# Altium project MC3_r2.PrjPcb (part 1 of 10)
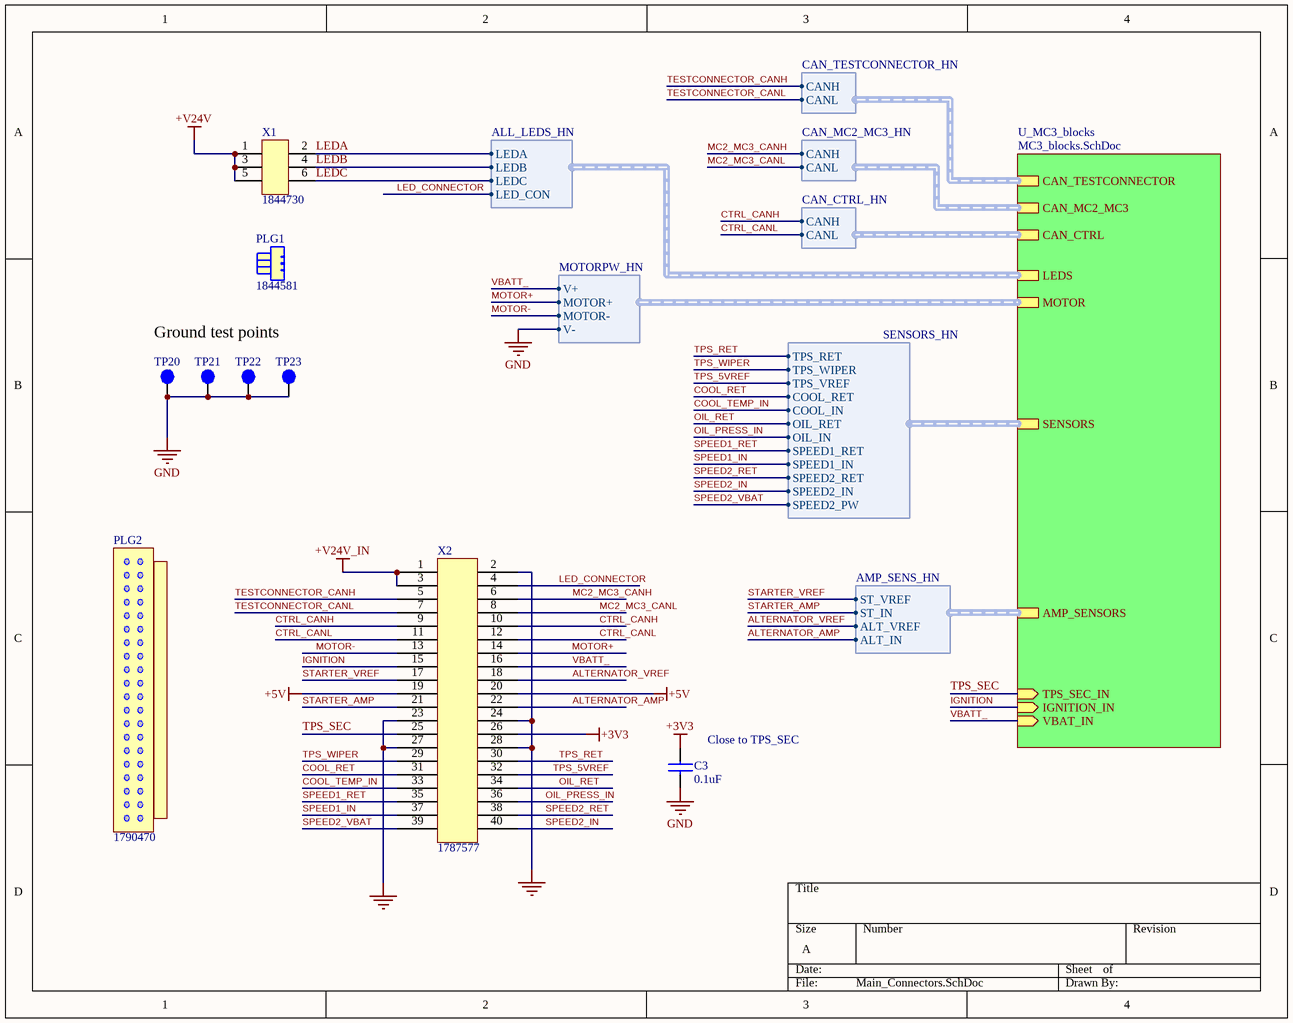
[diagram p0: Main_Connectors.SchDoc]
21 sheets, 353 parts. Net scope: hierarchical (ports join the sheet entries above them; power ports are global).
Board file: MC3.PcbDoc
Sheets:
  Main_Connectors.SchDoc
    U_MC3_blocks = MC3_blocks.SchDoc
      U_MC3_module = MC3_module.SchDoc
        U_CAN = CAN.SchDoc
        U_MC3_microcontroller = MC3_microcontroller.SchDoc
          U_I2cLevelShifter = I2cLevelShifter.SchDoc
        U_RPM Inputs = RPM Inputs.SchDoc
        U_AD_starter_alternator = AD_starter_alternator.SchDoc
        U_AD_Sensors = AD_Sensors.SchDoc
        U_DigitalInputs = DigitalInputs.SchDoc
        U_MC_Connector = MC_Connector.SchDoc
          RLA = RelayG6K2FY.SchDoc
          RLB = RelayG6K2FY.SchDoc
          RLC = RelayG6K2FY.SchDoc
          RLD = RelayG6K2FY.SchDoc
          RLE = RelayG6K2FY.SchDoc
          RLF = RelayG6K2FY.SchDoc
        U_DCMotorControl = DCMotorControl.SchDoc
        U_TPS_secondary_wiper = TPS_secondary_wiper.SchDoc
        U_CAN2 = CAN.SchDoc
      U_PowerSupply = PowerSupply.SchDoc
      U_CanFaults = CanFaults.SchDoc
        A1P = FaultRelay.SchDoc
        A1N = FaultRelay.SchDoc
        B1P = FaultRelay.SchDoc
        B1N = FaultRelay.SchDoc
        C1P = FaultRelay.SchDoc
        C1N = FaultRelay.SchDoc
        CONA = CanConnector.SchDoc
        CONB = CanConnector.SchDoc
        CONC = CanConnector.SchDoc
      U_Fault_Module = Fault_Module.SchDoc
        U_FaultOptoNC = FaultOptoNC.SchDoc
        U_FaultOptoNC = FaultOptoNC.SchDoc
        U_FaultOptoNC = FaultOptoNC.SchDoc
        U_FaultOptoNO = FaultOptoNO.SchDoc

## Sheet Main_Connectors.SchDoc
size A; DocumentNumber: D_1; SheetNumber: 1; SheetTotal: 21

### Parts
C3  0.1uF  [C0805]
PLG1  1844581  (mechanical)
PLG2  1790470  (mechanical)
TP20  T  [TESTPOINTSMD_1x1MM]  (value not drawn)  (no BOM)
TP21  T  [TESTPOINTSMD_1x1MM]  (value not drawn)  (no BOM)
TP22  T  [TESTPOINTSMD_1x1MM]  (value not drawn)  (no BOM)
TP23  T  [TESTPOINTSMD_1x1MM]  (value not drawn)  (no BOM)
X1  1844730  [DMC 0,5/ 3-G1- 2,54 P20THR R24]
X2  1787577  [DMCV 1,5/20-G1F-3,5-LR P20THR]

### Sub-sheets
U_MC3_blocks = MC3_blocks.SchDoc: SENSORS (harness SENSORS_HN), CAN_TESTCONNECTOR (harness CAN_TESTCONNECTOR_HN), CAN_MC2_MC3 (harness CAN_MC2_MC3_HN), CAN_CTRL (harness CAN_CTRL_HN), LEDS (harness ALL_LEDS_HN), MOTOR (harness MOTORPW_HN), AMP_SENSORS (harness AMP_SENS_HN), TPS_SEC_IN (in), IGNITION_IN (in), VBAT_IN (in)

### Harnesses
CAN_TESTCONNECTOR_HN: CANH, CANL
CAN_MC2_MC3_HN: CANH, CANL
CAN_CTRL_HN: CANH, CANL
ALL_LEDS_HN: LEDA, LEDB, LEDC, LED_CON
MOTORPW_HN: V+, MOTOR+, MOTOR-, V-
SENSORS_HN: TPS_RET, TPS_WIPER, TPS_VREF, COOL_RET, COOL_IN, OIL_RET, OIL_IN, SPEED1_RET, SPEED1_IN, SPEED2_RET, SPEED2_IN, SPEED2_PW
AMP_SENS_HN: ST_VREF, ST_IN, ALT_VREF, ALT_IN

### Nets
+3V3: C3.1 X2.26
+5V: X2.19 X2.20
+V24V: X1.1 X1.3 X1.5
+V24V_IN: X2.1 X2.3
GND: C3.2 TP20.1 TP21.1 TP22.1 TP23.1 X2.2 X2.23 X2.24 X2.27 X2.28 ; sheet U_MC3_blocks/MOTOR.V-
ALTERNATOR_AMP: X2.22 ; sheet U_MC3_blocks/AMP_SENSORS.ALT_IN
ALTERNATOR_VREF: X2.18 ; sheet U_MC3_blocks/AMP_SENSORS.ALT_VREF
COOL_RET: X2.31 ; sheet U_MC3_blocks/SENSORS.COOL_RET
COOL_TEMP_IN: X2.33 ; sheet U_MC3_blocks/SENSORS.COOL_IN
CTRL_CANH: X2.9 X2.10 ; sheet U_MC3_blocks/CAN_CTRL.CANH
CTRL_CANL: X2.11 X2.12 ; sheet U_MC3_blocks/CAN_CTRL.CANL
IGNITION: X2.15 ; sheet U_MC3_blocks/IGNITION_IN
LED_CONNECTOR: X2.4 ; sheet U_MC3_blocks/LEDS.LED_CON
LEDA: X1.2 ; sheet U_MC3_blocks/LEDS.LEDA
LEDB: X1.4 ; sheet U_MC3_blocks/LEDS.LEDB
LEDC: X1.6 ; sheet U_MC3_blocks/LEDS.LEDC
MC2_MC3_CANH: X2.6 ; sheet U_MC3_blocks/CAN_MC2_MC3.CANH
MC2_MC3_CANL: X2.8 ; sheet U_MC3_blocks/CAN_MC2_MC3.CANL
MOTOR+: X2.14 ; sheet U_MC3_blocks/MOTOR.MOTOR+
MOTOR-: X2.13 ; sheet U_MC3_blocks/MOTOR.MOTOR-
OIL_PRESS_IN: X2.36 ; sheet U_MC3_blocks/SENSORS.OIL_IN
OIL_RET: X2.34 ; sheet U_MC3_blocks/SENSORS.OIL_RET
SPEED1_IN: X2.37 ; sheet U_MC3_blocks/SENSORS.SPEED1_IN
SPEED1_RET: X2.35 ; sheet U_MC3_blocks/SENSORS.SPEED1_RET
SPEED2_IN: X2.40 ; sheet U_MC3_blocks/SENSORS.SPEED2_IN
SPEED2_RET: X2.38 ; sheet U_MC3_blocks/SENSORS.SPEED2_RET
SPEED2_VBAT: X2.39 ; sheet U_MC3_blocks/SENSORS.SPEED2_PW
STARTER_AMP: X2.21 ; sheet U_MC3_blocks/AMP_SENSORS.ST_IN
STARTER_VREF: X2.17 ; sheet U_MC3_blocks/AMP_SENSORS.ST_VREF
TESTCONNECTOR_CANH: X2.5 ; sheet U_MC3_blocks/CAN_TESTCONNECTOR.CANH
TESTCONNECTOR_CANL: X2.7 ; sheet U_MC3_blocks/CAN_TESTCONNECTOR.CANL
TPS_5VREF: X2.32 ; sheet U_MC3_blocks/SENSORS.TPS_VREF
TPS_RET: X2.30 ; sheet U_MC3_blocks/SENSORS.TPS_RET
TPS_SEC: X2.25 ; sheet U_MC3_blocks/TPS_SEC_IN
TPS_WIPER: X2.29 ; sheet U_MC3_blocks/SENSORS.TPS_WIPER
VBATT_: X2.16 ; sheet U_MC3_blocks/VBAT_IN, sheet U_MC3_blocks/MOTOR.V+

### Notes on the sheet
- Ground test points
- (near C3) Close to TPS_SEC

### Library data of the parts
C3 = C0805C104K5RACTU: Cap Ceramic 0.1uF 50V X7R 10% SMD 2.0 x 1.2 mm 125 C Paper T/R; Manufacturer: KEMET; Capacitance: 100nF; Voltage: 500V; Supplier 1: Mouser; Supplier Part Number 1: 80-C0805C104K5R; Manufacturer Part Number: C0805C104K5RACTU; RoHS: Yes; Category: Ceramic Capacitors; Stock 1: 4177670; Pricing 1: 1=0.17000, 10=0.10400, 100=0.05600, 500=0.03900, 1000=0.03200, 4000=0.02400 (USD); Mount: Surface Mount,PCB; Case/Package: 0805; Number of Pins: 2; Case Code (Imperial): 0805; Case Code (Metric): 2012; Dielectric Material: Ceramic; Contact Plating: Tin,Matte; Min Operating Temperature: -55°C; Max Operating Temperature: 125°C; Voltage Rating: 50V; Tolerance: 10%; Packaging: Tape and Reel; Dielectric: X7R; Package Quantity: 4000; Voltage Rating (DC): 50V; Termination: SMD/SMT; Length: 2mm; Height: 0.9mm; Width: 1.2mm; Depth: 1.25mm; Thickness: 0.035inch; Lead Pitch: 0.75mm; Radiation Hardening: No; REACH SVHC: No SVHC; ComponentLink1URL: https://datasheet.ciiva.com/14589/70095383-14589048.pdf?src-supplier=Allied+Electronics; ComponentLink1Description: https://datasheet.ciiva.com/14589/70095383-14589048.pdf?src-supplier=Allied+Electronics; ComponentLink2URL: https://datasheet.ciiva.com/28682/1851736-28682232.pdf?src-supplier=Element14; ComponentLink2Description: https://datasheet.ciiva.com/28682/1851736-28682232.pdf?src-supplier=Element14; ComponentLink3URL: https://datasheet.ciiva.com/32431/slceramic-chip-condensers-e-32431755.pdf?src-supplier=Distrelec; ComponentLink3Description: https://datasheet.ciiva.com/32431/slceramic-chip-condensers-e-32431755.pdf?src-supplier=Distrelec; ComponentLink4URL: https://datasheet.ciiva.com/18410/70095383-18410815.pdf?src-supplier=Allied+Electronics; ComponentLink4Description: https://datasheet.ciiva.com/18410/70095383-18410815.pdf?src-supplier=Allied+Electronics
PLG1 = 1844581: Terminal block; plug; 6 positions; 0.100"(2.54mm) pitch; Screwless; 6A; 150V; Black; Manufacturer: Phoenix Contact; Number of Positions: 6; Number of Positions Per Level: 3; Number of Levels: 2; Pitch: 0.1inch; Wire Gauge (Max): 26AWG; Wire Gauge (Min): 20AWG; Supplier 1: Mouser; Supplier Part Number 1: 651-1844581; Manufacturer Part Number: 1844581; RoHS: Yes; Category: Terminal Blocks; Stock 1: 365; Pricing 1: 1=5.22000, 10=4.99000, 25=4.92000, 50=4.85000, 100=4.54000, 250=4.17000, 500=3.85000, 1000=3.67000, 2500=3.45000 (USD); Mount: Free Hanging; Number of Pins: 6; Color: Black; Contact Plating: Gold; Housing Color: Black; Packaging: Bulk; Termination: Screwless; Current: 6A; Voltage: 150V; ComponentLink1URL: https://media.digikey.com/pdf/Data%20Sheets/Phoenix%20Contact%20PDFs/1844581.pdf?src-supplier=Digi-Key; ComponentLink1Description: https://media.digikey.com/pdf/Data%20Sheets/Phoenix%20Contact%20PDFs/1844581.pdf?src-supplier=Digi-Key
PLG2 = 1790470: 40 position; 8A; 250V; Push-in;Terminal block; PCB; Plug; Female Sockets;; Manufacturer: Phoenix Contact; Number of Positions: 40; Number of Positions Per Level: 20; Number of Levels: 2; Voltage: 150V; Voltage Rating: 160V; Connector Type: Screw; Pitch: 0.138inch; Wire Gauge (Max): 16AWG; Wire Gauge (Min): 24AWG; Supplier 1: Mouser; Supplier Part Number 1: 651-1790470; Manufacturer Part Number: 1790470; RoHS: Yes; Category: Terminal Blocks; Stock 1: 94; Pricing 1: 1=32.15000, 10=31.27000, 25=30.47000, 50=29.22000, 100=26.89000, 250=24.84000 (USD); Mount: Free Hanging; Color: Green; Contact Plating: Tin; Housing Color: Green; Housing Material: Plastic; Package Quantity: 1; Termination: Screwless; Current: 8A; Current Rating: 8A; Packaging: Bulk; ComponentLink1URL: https://datasheet.ciiva.com/15056/1790470-15056229.pdf?src-supplier=Digi-Key; ComponentLink1Description: https://datasheet.ciiva.com/15056/1790470-15056229.pdf?src-supplier=Digi-Key; ComponentLink2URL: https://datasheet.ciiva.com/14913/1790470-14913096.pdf?src-supplier=Arrow+Electronics; ComponentLink2Description: https://datasheet.ciiva.com/14913/1790470-14913096.pdf?src-supplier=Arrow+Electronics; ComponentLink3URL: https://datasheet.ciiva.com/818/1790470-818583.pdf?src-supplier=Digi-Key; ComponentLink3Description: https://datasheet.ciiva.com/818/1790470-818583.pdf?src-supplier=Digi-Key
TP20-TP23 = TestPoint_SMD_1x1: SMD Test Point
X1 = 1844730: Terminal block; Header; Male Pins; (4 Side); 6 pos; 0.100"(2.54mm) pitch; 6A; 150V; Manufacturer: Phoenix Contact; Number of Positions: 6; Number of Positions Per Level: 3; Number of Levels: 2; Supplier 1: Mouser; Supplier Part Number 1: 651-1844730; Manufacturer Part Number: 1844730; RoHS: No; Category: Terminal Blocks; Stock 1: 975; Pricing 1: 1=3.31000, 10=3.17000, 50=3.03000, 100=2.95000, 250=2.75000, 500=2.54000 (USD); Mount: Through Hole; Number of Pins: 6; Color: Black; Contact Plating: Gold; Packaging: Tape and Reel; Termination: Solder; Current: 6A; Voltage: 150V; ComponentLink1URL: https://media.digikey.com/pdf/Data%20Sheets/Phoenix%20Contact%20PDFs/1844730.pdf?src-supplier=Digi-Key; ComponentLink1Description: https://media.digikey.com/pdf/Data%20Sheets/Phoenix%20Contact%20PDFs/1844730.pdf?src-supplier=Digi-Key
X2 = 1787577: 40 pins PCB header Phoenix Contact 1787577 Contact spacing: 3.50 mm; Current Rating: 8A; Connector Type: Plug; Number of Positions: 20; Number of Levels: 2; Voltage: 150V; Voltage Rating: 160V; Pitch: 0.138inch; Supplier 1: Mouser; Manufacturer: Phoenix Contact; Manufacturer Part Number: 1787577; RoHS: Yes; Category: Terminal Blocks; Stock 1: 89; Pricing 1: 1=14.81000, 10=14.41000, 25=14.04000, 50=13.46000, 100=12.39000, 250=11.45000 (USD); Mount: Through Hole; Contact Plating: Tin; Color: Black; Contact Material: Tin; Housing Color: Black; Package Quantity: 50; Packaging: Bulk; Number of Rows: 2; Termination: Solder; Number of Positions Per Level: 20; Current: 8A; Orientation: Vertical; Length: 10.6mm; Height: 12mm; Width: 77mm; ComponentLink1URL: https://datasheet.ciiva.com/817/1787577-817976.pdf?src-supplier=Digi-Key; ComponentLink1Description: https://datasheet.ciiva.com/817/1787577-817976.pdf?src-supplier=Digi-Key; ComponentLink2URL: https://datasheet.ciiva.com/29212/772230-da-01-de-grundgehaeuse-1787577-50-st-29212411.pdf?src-supplier=Conrad; ComponentLink2Description: https://datasheet.ciiva.com/29212/772230-da-01-de-grundgehaeuse-1787577-50-st-29212411.pdf?src-supplier=Conrad; Supplier Part Number 1: 651-1787577

## Sheet MC3_blocks.SchDoc
size Letter; Organization: Altium Limited; Address1: L3, 12a Rodborough Rd; Address2: Frenchs Forest; Address3: NSW; Address4: Australia 2086; DocumentNumber: D_2; SheetNumber: 2; SheetTotal: 21
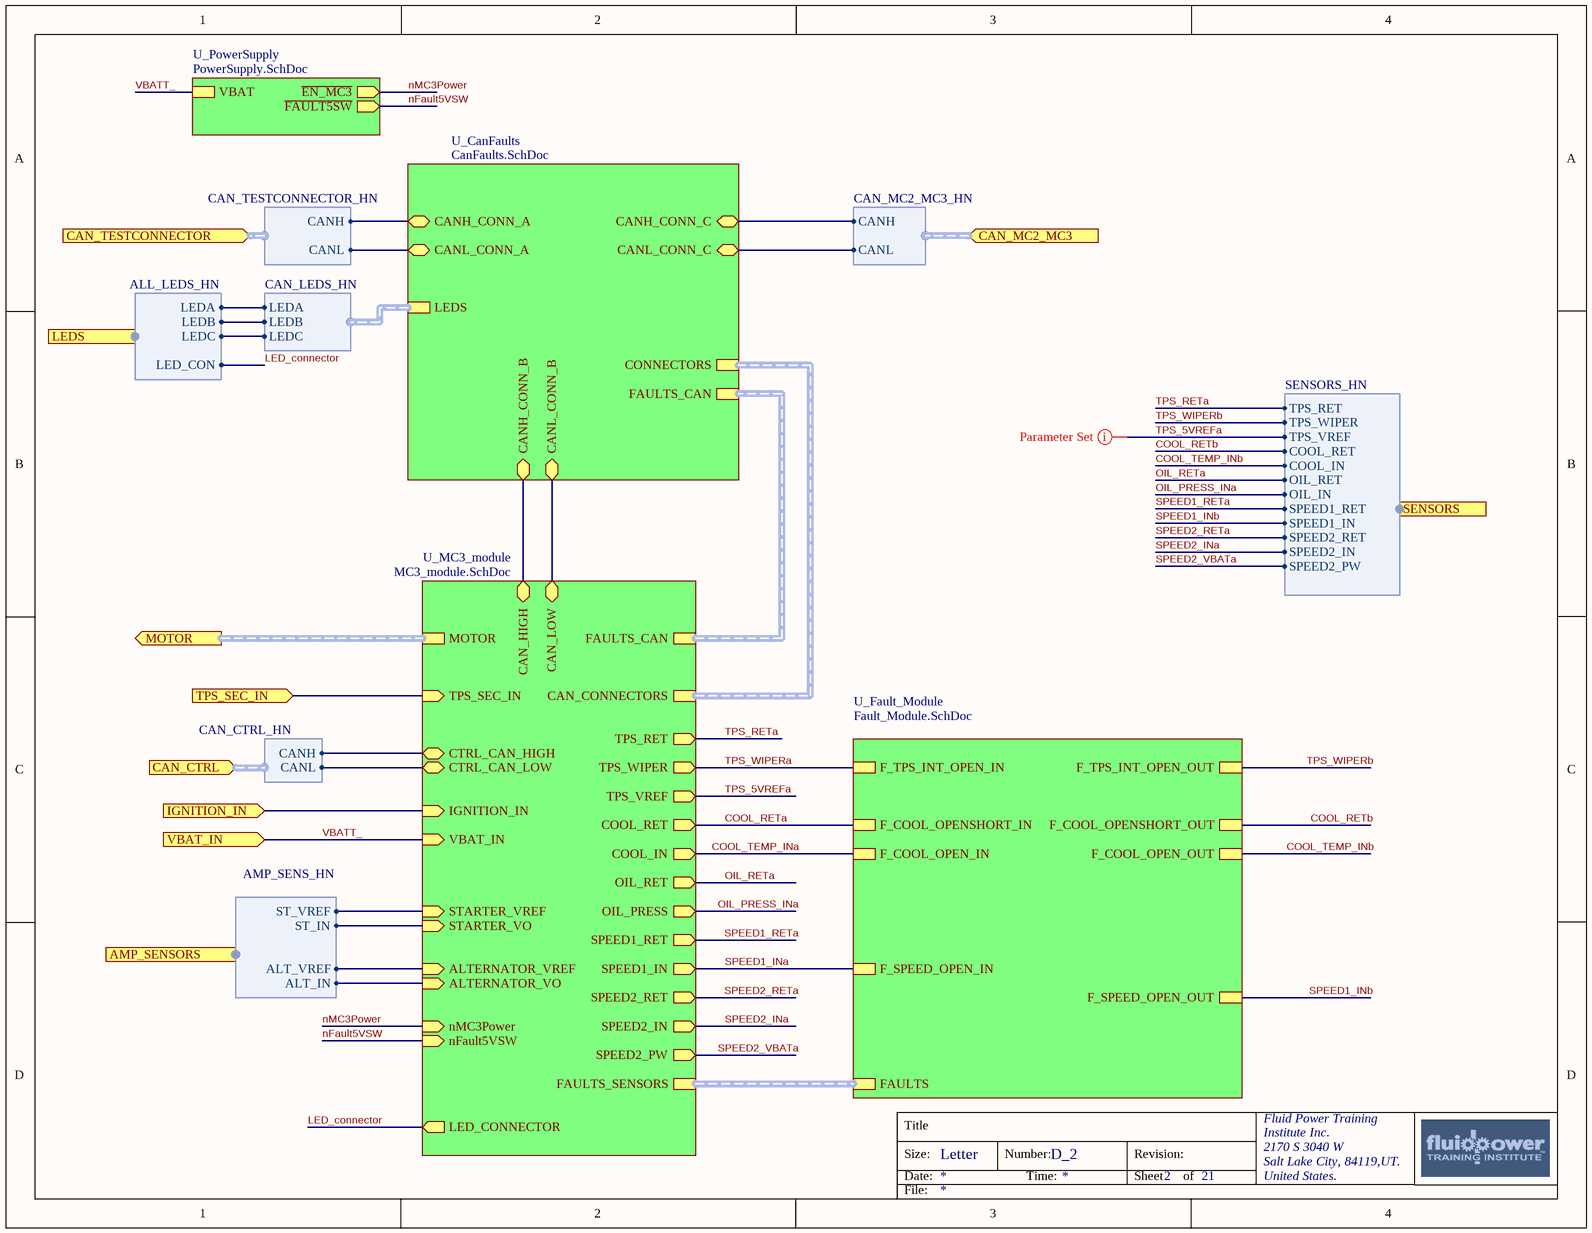
[diagram p1: MC3_blocks.SchDoc]

### Sub-sheets
U_CanFaults = CanFaults.SchDoc: CANH_CONN_A (bidir), CANL_CONN_A (bidir), CANH_CONN_B (bidir), CANL_CONN_B (bidir), CANH_CONN_C (bidir), CANL_CONN_C (bidir), FAULTS_CAN (harness FAULTSCAN_HN), CONNECTORS (harness CONNECTORS_HN), LEDS (harness CAN_LEDS_HN)
U_Fault_Module = Fault_Module.SchDoc: F_SPEED_OPEN_IN, F_SPEED_OPEN_OUT, F_TPS_INT_OPEN_IN, F_TPS_INT_OPEN_OUT, F_COOL_OPEN_IN, F_COOL_OPEN_OUT, F_COOL_OPENSHORT_OUT, F_COOL_OPENSHORT_IN, FAULTS (harness FAULTSSENSORS_HN)
U_MC3_module = MC3_module.SchDoc: STARTER_VREF (in), ALTERNATOR_VREF (in), STARTER_VO (in), ALTERNATOR_VO (in), CAN_HIGH (bidir), CAN_LOW (bidir), IGNITION_IN (in), VBAT_IN (in), SPEED2_PW (out), OIL_PRESS (out), TPS_VREF (out), COOL_IN (out), OIL_RET (out), TPS_RET (out), TPS_WIPER (out), SPEED1_RET (out), SPEED1_IN (out), COOL_RET (out), SPEED2_IN (out), SPEED2_RET (out), CAN_CONNECTORS (harness CONNECTORS_HN), nMC3Power (in), nFault5VSW (in), TPS_SEC_IN (in), CTRL_CAN_HIGH (bidir), CTRL_CAN_LOW (bidir), FAULTS_SENSORS (harness FAULTSSENSORS_HN), FAULTS_CAN (harness FAULTSCAN_HN), LED_CONNECTOR (out), MOTOR (harness MOTORPW_HN)
U_PowerSupply = PowerSupply.SchDoc: VBAT, ~{EN_MC3} (out), ~{FAULT5SW} (out)

### Ports
AMP_SENSORS (out, harness AMP_SENS_HN), CAN_CTRL (in, harness CAN_CTRL_HN), CAN_MC2_MC3 (in, harness CAN_MC2_MC3_HN), CAN_TESTCONNECTOR (in, harness CAN_TESTCONNECTOR_HN), IGNITION_IN (in), LEDS (out, harness ALL_LEDS_HN), MOTOR (out, harness MOTORPW_HN), SENSORS (in, harness SENSORS_HN), TPS_SEC_IN (in), VBAT_IN (in)

### Harnesses
SENSORS_HN: TPS_RET, TPS_WIPER, TPS_VREF, COOL_RET, COOL_IN, OIL_RET, OIL_IN, SPEED1_RET, SPEED1_IN, SPEED2_RET, SPEED2_IN, SPEED2_PW
CAN_TESTCONNECTOR_HN: CANH, CANL
CAN_MC2_MC3_HN: CANH, CANL
CAN_CTRL_HN: CANH, CANL
CAN_LEDS_HN: LEDA, LEDB, LEDC
ALL_LEDS_HN: LEDA, LEDB, LEDC, LED_CON
AMP_SENS_HN: ST_VREF, ST_IN, ALT_VREF, ALT_IN

### Nets
ALTERNATOR_AMP: sheet U_MC3_module/ALTERNATOR_VO, port AMP_SENSORS.ALT_IN
ALTERNATOR_VREF: sheet U_MC3_module/ALTERNATOR_VREF, port AMP_SENSORS.ALT_VREF
COOL_RETa: sheet U_MC3_module/COOL_RET, sheet U_Fault_Module/F_COOL_OPENSHORT_OUT, sheet U_Fault_Module/F_COOL_OPENSHORT_IN, port SENSORS.COOL_RET  [also labelled COOL_RETb]  [project net COOL_RET]
COOL_TEMP_INa: sheet U_MC3_module/COOL_IN, sheet U_Fault_Module/F_COOL_OPEN_IN
COOL_TEMP_INb: sheet U_Fault_Module/F_COOL_OPEN_OUT, port SENSORS.COOL_IN  [project net COOL_TEMP_IN]
CTRL_CANH: sheet U_MC3_module/CTRL_CAN_HIGH, port CAN_CTRL.CANH
CTRL_CANL: sheet U_MC3_module/CTRL_CAN_LOW, port CAN_CTRL.CANL
IGNITION: port IGNITION_IN, sheet U_MC3_module/IGNITION_IN
LED_CONNECTOR: sheet U_MC3_module/LED_CONNECTOR, port LEDS.LED_CON
LEDA: sheet U_CanFaults/LEDS.LEDA, port LEDS.LEDA
LEDB: sheet U_CanFaults/LEDS.LEDB, port LEDS.LEDB
LEDC: sheet U_CanFaults/LEDS.LEDC, port LEDS.LEDC
MC2_MC3_CANH: sheet U_CanFaults/CANH_CONN_C, port CAN_MC2_MC3.CANH
MC2_MC3_CANL: sheet U_CanFaults/CANL_CONN_C, port CAN_MC2_MC3.CANL
nFault5VSW: sheet U_MC3_module/nFault5VSW, sheet U_PowerSupply/~{FAULT5SW}
nMC3Power: sheet U_MC3_module/nMC3Power, sheet U_PowerSupply/~{EN_MC3}
OIL_PRESS_INa: sheet U_MC3_module/OIL_PRESS, port SENSORS.OIL_IN  [project net OIL_PRESS_IN]
OIL_RETa: sheet U_MC3_module/OIL_RET, port SENSORS.OIL_RET  [project net OIL_RET]
SPEED1_INa: sheet U_MC3_module/SPEED1_IN, sheet U_Fault_Module/F_SPEED_OPEN_IN
SPEED1_INb: sheet U_Fault_Module/F_SPEED_OPEN_OUT, port SENSORS.SPEED1_IN  [project net SPEED1_IN]
SPEED1_RETa: sheet U_MC3_module/SPEED1_RET, port SENSORS.SPEED1_RET  [project net SPEED1_RET]
SPEED2_INa: sheet U_MC3_module/SPEED2_IN, port SENSORS.SPEED2_IN  [project net SPEED2_IN]
SPEED2_RETa: sheet U_MC3_module/SPEED2_RET, port SENSORS.SPEED2_RET  [project net SPEED2_RET]
SPEED2_VBATa: sheet U_MC3_module/SPEED2_PW, port SENSORS.SPEED2_PW  [project net SPEED2_VBAT]
STARTER_AMP: sheet U_MC3_module/STARTER_VO, port AMP_SENSORS.ST_IN
STARTER_VREF: sheet U_MC3_module/STARTER_VREF, port AMP_SENSORS.ST_VREF
TESTCONNECTOR_CANH: sheet U_CanFaults/CANH_CONN_A, port CAN_TESTCONNECTOR.CANH
TESTCONNECTOR_CANL: sheet U_CanFaults/CANL_CONN_A, port CAN_TESTCONNECTOR.CANL
TPS_5VREFa: sheet U_MC3_module/TPS_VREF, port SENSORS.TPS_VREF  [project net TPS_5VREF]
TPS_RETa: sheet U_MC3_module/TPS_RET, port SENSORS.TPS_RET  [project net TPS_RET]
TPS_SEC: port TPS_SEC_IN, sheet U_MC3_module/TPS_SEC_IN
TPS_WIPERa: sheet U_MC3_module/TPS_WIPER, sheet U_Fault_Module/F_TPS_INT_OPEN_IN
TPS_WIPERb: sheet U_Fault_Module/F_TPS_INT_OPEN_OUT, port SENSORS.TPS_WIPER  [project net TPS_WIPER]
VBATT_: port VBAT_IN, sheet U_MC3_module/VBAT_IN, sheet U_PowerSupply/VBAT
NetBH35_1: sheet U_MC3_module/CAN_HIGH, sheet U_CanFaults/CANH_CONN_B
NetBH39_1: sheet U_MC3_module/CAN_LOW, sheet U_CanFaults/CANL_CONN_B

### Buses and harness runs
harness port MOTOR = sheet U_MC3_module/MOTOR
harness sheet U_CanFaults/CONNECTORS = sheet U_MC3_module/CAN_CONNECTORS
harness sheet U_CanFaults/FAULTS_CAN = sheet U_MC3_module/FAULTS_CAN
harness sheet U_Fault_Module/FAULTS = sheet U_MC3_module/FAULTS_SENSORS

### Layout directives
net class VREF: TPS_5VREF

### Notes on the sheet
- Title
- Size:
- Date:
- Letter
- Number:
- Time:
- Revision:
- Sheet
- of
- Fluid Power Training
- Institute Inc.
- 2170 S 3040 W
- Salt Lake City, 84119,UT.
- United States.
- File:

## Sheet MC3_module.SchDoc
size Letter; Organization: Altium Limited; Address1: L3, 12a Rodborough Rd; Address2: Frenchs Forest; Address3: NSW; Address4: Australia 2086; DocumentNumber: D_5; SheetNumber: 5; SheetTotal: 21
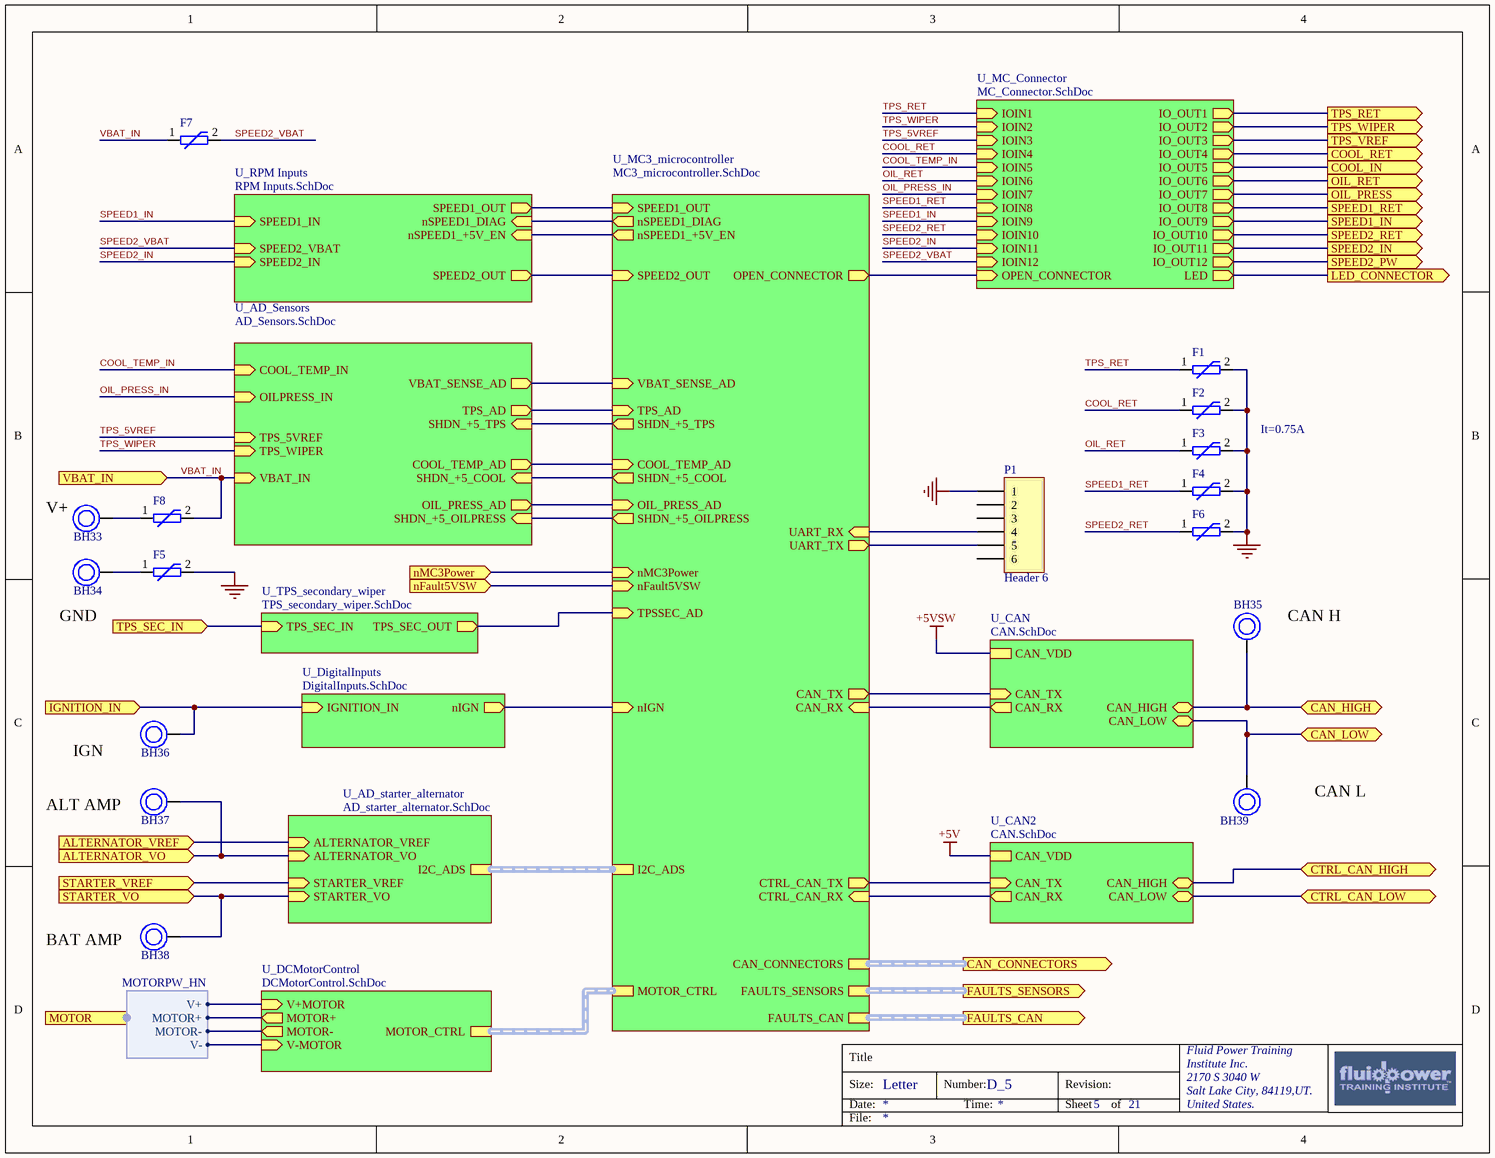
[diagram p2: MC3_module.SchDoc]

### Parts
BH33  BananaHole  [BananaHole]  (value not drawn)  (no BOM)
BH34  BananaHole  [BananaHole]  (value not drawn)  (no BOM)
BH35  BananaHole  [BananaHole]  (value not drawn)  (no BOM)
BH36  BananaHole  [BananaHole]  (value not drawn)  (no BOM)
BH37  BananaHole  [BananaHole]  (value not drawn)  (no BOM)
BH38  BananaHole  [BananaHole]  (value not drawn)  (no BOM)
BH39  BananaHole  [BananaHole]  (value not drawn)  (no BOM)
F1  It=0.75A  [0ZCJ0035AF2E_FUSE]
F2  It=0.75A  [0ZCJ0035AF2E_FUSE]  (value not drawn)
F3  It=0.75A  [0ZCJ0035AF2E_FUSE]  (value not drawn)
F4  It=0.75A  [0ZCJ0035AF2E_FUSE]  (value not drawn)
F5  It=0.75A  [0ZCJ0035AF2E_FUSE]  (value not drawn)
F6  It=0.75A  [0ZCJ0035AF2E_FUSE]  (value not drawn)
F7  It=0.75A  [0ZCJ0035AF2E_FUSE]  (value not drawn)
F8  It=0.75A  [0ZCJ0035AF2E_FUSE]  (value not drawn)
P1  Header 6  [HDR1X6]  (no BOM)

### Sub-sheets
U_AD_Sensors = AD_Sensors.SchDoc: VBAT_SENSE_AD (out), TPS_AD (out), SHDN_+5_TPS (in), COOL_TEMP_AD (out), SHDN_+5_OILPRESS (in), SHDN_+5_COOL (in), OIL_PRESS_AD (out), COOL_TEMP_IN (in), OILPRESS_IN (in), TPS_5VREF (in), TPS_WIPER (in), VBAT_IN (in)
U_AD_starter_alternator = AD_starter_alternator.SchDoc: ALTERNATOR_VO (in), ALTERNATOR_VREF (in), STARTER_VREF (in), STARTER_VO (in), I2C_ADS (harness I2C_ADS)
U_CAN = CAN.SchDoc: CAN_TX (in), CAN_RX (out), CAN_VDD, CAN_HIGH (bidir), CAN_LOW (bidir)
U_CAN2 = CAN.SchDoc: CAN_TX (in), CAN_RX (out), CAN_VDD, CAN_HIGH (bidir), CAN_LOW (bidir)
U_DCMotorControl = DCMotorControl.SchDoc: V+MOTOR (in), V-MOTOR (in), MOTOR+ (out), MOTOR- (out), MOTOR_CTRL (harness MOTOR_HN)
U_DigitalInputs = DigitalInputs.SchDoc: nIGN (out), IGNITION_IN (in)
U_MC3_microcontroller = MC3_microcontroller.SchDoc: nSPEED1_+5V_EN (out), SHDN_+5_OILPRESS (out), SHDN_+5_COOL (out), COOL_TEMP_AD (in), CAN_RX (in), VBAT_SENSE_AD (in), TPS_AD (in), SPEED1_OUT (in), nIGN (in), SPEED2_OUT (in), nSPEED1_DIAG (out), UART_RX (in), SHDN_+5_TPS (out), CAN_TX (out), OIL_PRESS_AD (in), UART_TX (out), I2C_ADS (harness I2C_ADS), MOTOR_CTRL (harness MOTOR_HN), CAN_CONNECTORS (harness CONNECTORS_HN), nMC3Power (in), TPSSEC_AD (in), nFault5VSW (in), OPEN_CONNECTOR (out), CTRL_CAN_TX (out), CTRL_CAN_RX (in), FAULTS_CAN (harness FAULTSCAN_HN), FAULTS_SENSORS (harness FAULTSSENSORS_HN)
U_MC_Connector = MC_Connector.SchDoc: IOIN1 (in), IOIN2 (in), IOIN3 (in), IOIN4 (in), IOIN5 (in), IOIN6 (in), IOIN7 (in), IOIN8 (in), IOIN9 (in), IOIN10 (in), IOIN11 (in), IOIN12 (in), IO_OUT1 (out), IO_OUT2 (out), IO_OUT3 (out), IO_OUT4 (out), IO_OUT5 (out), IO_OUT6 (out), IO_OUT7 (out), IO_OUT8 (out), IO_OUT9 (out), IO_OUT10 (out), IO_OUT11 (out), IO_OUT12 (out), OPEN_CONNECTOR (in), LED (out)
U_RPM Inputs = RPM Inputs.SchDoc: nSPEED1_DIAG (in), SPEED1_IN (in), nSPEED1_+5V_EN (in), SPEED1_OUT (out), SPEED2_OUT (out), SPEED2_VBAT (in), SPEED2_IN (in)
U_TPS_secondary_wiper = TPS_secondary_wiper.SchDoc: TPS_SEC_OUT (out), TPS_SEC_IN (in)

### Ports
ALTERNATOR_VO (in), ALTERNATOR_VREF (in), CAN_CONNECTORS (out, harness CONNECTORS_HN), CAN_HIGH (bidir), CAN_LOW (bidir), COOL_IN (out), COOL_RET (out), CTRL_CAN_HIGH (bidir), CTRL_CAN_LOW (bidir), FAULTS_CAN (out, harness FAULTSCAN_HN), FAULTS_SENSORS (out, harness FAULTSSENSORS_HN), IGNITION_IN (in), LED_CONNECTOR (out), MOTOR (out, harness MOTORPW_HN), nFault5VSW (in), nMC3Power (in), OIL_PRESS (out), OIL_RET (out), SPEED1_IN (out), SPEED1_RET (out), SPEED2_IN (out), SPEED2_PW (out), SPEED2_RET (out), STARTER_VO (in), STARTER_VREF (in), TPS_RET (out), TPS_SEC_IN (in), TPS_VREF (out), TPS_WIPER (out), VBAT_IN (in)

### Harnesses
MOTORPW_HN: V+, MOTOR+, MOTOR-, V-

### Nets
GND: F1.2 F2.2 F3.2 F4.2 F5.2 F6.2 P1.1 ; sheet U_DCMotorControl/V-MOTOR, port MOTOR.V-
~{SPEED_DIAG}: sheet U_MC3_microcontroller/nSPEED1_DIAG, sheet U_RPM Inputs/nSPEED1_DIAG
~{SPEED_EN}: sheet U_MC3_microcontroller/nSPEED1_+5V_EN, sheet U_RPM Inputs/nSPEED1_+5V_EN
ALTERNATOR_AMP: BH37.1 ; port ALTERNATOR_VO, sheet U_AD_starter_alternator/ALTERNATOR_VO
ALTERNATOR_VREF: port ALTERNATOR_VREF, sheet U_AD_starter_alternator/ALTERNATOR_VREF
CAN1_RX: sheet U_CAN/CAN_RX, sheet U_MC3_microcontroller/CAN_RX
CAN1_TX: sheet U_CAN/CAN_TX, sheet U_MC3_microcontroller/CAN_TX
CAN2_RX: sheet U_MC3_microcontroller/CTRL_CAN_RX, sheet U_CAN2/CAN_RX
CAN2_TX: sheet U_MC3_microcontroller/CTRL_CAN_TX, sheet U_CAN2/CAN_TX
COOL_AD: sheet U_MC3_microcontroller/COOL_TEMP_AD, sheet U_AD_Sensors/COOL_TEMP_AD
COOL_RET: port COOL_RET, sheet U_MC_Connector/IO_OUT4
COOL_RET: F2.1 ; sheet U_MC_Connector/IOIN4  [a separate net that carries the same name]
COOL_TEMP_IN: sheet U_AD_Sensors/COOL_TEMP_IN, sheet U_MC_Connector/IOIN5
COOL_TEMP_INa: port COOL_IN, sheet U_MC_Connector/IO_OUT5
CTRL_CANH: port CTRL_CAN_HIGH, sheet U_CAN2/CAN_HIGH
CTRL_CANL: port CTRL_CAN_LOW, sheet U_CAN2/CAN_LOW
IGNITION: BH36.1 ; port IGNITION_IN, sheet U_DigitalInputs/IGNITION_IN
LED_CONNECTOR: port LED_CONNECTOR, sheet U_MC_Connector/LED
MOTOR+: sheet U_DCMotorControl/MOTOR+, port MOTOR.MOTOR+
MOTOR-: sheet U_DCMotorControl/MOTOR-, port MOTOR.MOTOR-
nFault5VSW: port nFault5VSW, sheet U_MC3_microcontroller/nFault5VSW
nIGNITION: sheet U_MC3_microcontroller/nIGN, sheet U_DigitalInputs/nIGN
nMC3Power: port nMC3Power, sheet U_MC3_microcontroller/nMC3Power
OIL_PRESS_IN: port OIL_PRESS, sheet U_MC_Connector/IO_OUT7
OIL_PRESS_IN: sheet U_AD_Sensors/OILPRESS_IN, sheet U_MC_Connector/IOIN7  [a separate net that carries the same name]
OIL_RET: port OIL_RET, sheet U_MC_Connector/IO_OUT6
OIL_RET: F3.1 ; sheet U_MC_Connector/IOIN6  [a separate net that carries the same name]
OILPRESSAD: sheet U_MC3_microcontroller/OIL_PRESS_AD, sheet U_AD_Sensors/OIL_PRESS_AD
Open_Connector: sheet U_MC3_microcontroller/OPEN_CONNECTOR, sheet U_MC_Connector/OPEN_CONNECTOR
SHDN_COOL: sheet U_MC3_microcontroller/SHDN_+5_COOL, sheet U_AD_Sensors/SHDN_+5_COOL
SHDN_OIL: sheet U_MC3_microcontroller/SHDN_+5_OILPRESS, sheet U_AD_Sensors/SHDN_+5_OILPRESS
SHDN_TPS: sheet U_MC3_microcontroller/SHDN_+5_TPS, sheet U_AD_Sensors/SHDN_+5_TPS
SPEED1_IN: sheet U_RPM Inputs/SPEED1_IN, sheet U_MC_Connector/IOIN9
SPEED1_INa: port SPEED1_IN, sheet U_MC_Connector/IO_OUT9
SPEED1_RET: port SPEED1_RET, sheet U_MC_Connector/IO_OUT8
SPEED1_RET: F4.1 ; sheet U_MC_Connector/IOIN8  [a separate net that carries the same name]
SPEED2_IN: port SPEED2_IN, sheet U_MC_Connector/IO_OUT11
SPEED2_IN: sheet U_RPM Inputs/SPEED2_IN, sheet U_MC_Connector/IOIN11  [a separate net that carries the same name]
SPEED2_RET: port SPEED2_RET, sheet U_MC_Connector/IO_OUT10
SPEED2_RET: F6.1 ; sheet U_MC_Connector/IOIN10  [a separate net that carries the same name]
SPEED2_VBAT: port SPEED2_PW, sheet U_MC_Connector/IO_OUT12
SPEED2_VBAT: F7.2 ; sheet U_RPM Inputs/SPEED2_VBAT, sheet U_MC_Connector/IOIN12  [a separate net that carries the same name]
SPEED_HALL: sheet U_MC3_microcontroller/SPEED2_OUT, sheet U_RPM Inputs/SPEED2_OUT
SPEED_RLC: sheet U_MC3_microcontroller/SPEED1_OUT, sheet U_RPM Inputs/SPEED1_OUT
STARTER_AMP: BH38.1 ; port STARTER_VO, sheet U_AD_starter_alternator/STARTER_VO
STARTER_VREF: port STARTER_VREF, sheet U_AD_starter_alternator/STARTER_VREF
TPS_5VREF: port TPS_VREF, sheet U_MC_Connector/IO_OUT3
TPS_5VREF: sheet U_AD_Sensors/TPS_5VREF, sheet U_MC_Connector/IOIN3  [a separate net that carries the same name]
TPS_RET: port TPS_RET, sheet U_MC_Connector/IO_OUT1
TPS_RET: F1.1 ; sheet U_MC_Connector/IOIN1  [a separate net that carries the same name]
TPS_SEC: port TPS_SEC_IN, sheet U_TPS_secondary_wiper/TPS_SEC_IN
TPS_SECAD: sheet U_MC3_microcontroller/TPSSEC_AD, sheet U_TPS_secondary_wiper/TPS_SEC_OUT
TPS_WIPER: sheet U_AD_Sensors/TPS_WIPER, sheet U_MC_Connector/IOIN2
TPS_WIPERa: port TPS_WIPER, sheet U_MC_Connector/IO_OUT2
TPSAD: sheet U_MC3_microcontroller/TPS_AD, sheet U_AD_Sensors/TPS_AD
UART_RX1: P1.4 ; sheet U_MC3_microcontroller/UART_RX
UART_TX1: P1.5 ; sheet U_MC3_microcontroller/UART_TX
VBAT_IN: F7.1 F8.2 ; port VBAT_IN, sheet U_AD_Sensors/VBAT_IN, sheet U_DCMotorControl/V+MOTOR, port MOTOR.V+  [project net VBATT_]
VBATS_AD: sheet U_MC3_microcontroller/VBAT_SENSE_AD, sheet U_AD_Sensors/VBAT_SENSE_AD
NetBH33_1: BH33.1 F8.1
NetBH34_1: BH34.1 F5.1
NetBH35_1: BH35.1 ; port CAN_HIGH, sheet U_CAN/CAN_HIGH
NetBH39_1: BH39.1 ; port CAN_LOW, sheet U_CAN/CAN_LOW

Not connected (* = marked no-connect by the designer): P1 2 3 6

### Buses and harness runs
harness port CAN_CONNECTORS = sheet U_MC3_microcontroller/CAN_CONNECTORS
harness port FAULTS_CAN = sheet U_MC3_microcontroller/FAULTS_CAN
harness port FAULTS_SENSORS = sheet U_MC3_microcontroller/FAULTS_SENSORS
harness sheet U_AD_starter_alternator/I2C_ADS = sheet U_MC3_microcontroller/I2C_ADS
harness sheet U_DCMotorControl/MOTOR_CTRL = sheet U_MC3_microcontroller/MOTOR_CTRL

### Notes on the sheet
- (near BH33) V+
- (near BH34) GND
- (near BH35) CAN H
- IGN
- ALT AMP
- CAN L
- BAT AMP
- Title
- Size:
- Date:
- Letter
- Number:
- Time:
- Revision:
- Sheet
- of
- Fluid Power Training
- Institute Inc.
- 2170 S 3040 W
- Salt Lake City, 84119,UT.
- United States.
- File:

### Library data of the parts
BH33-BH39 = BananaHole: Banana hole for panel testing and board mounting
F1-F8 = 0ZCJ0035AF2E: PTC RESET FUSE 30V 350MA 1206; Manufacturer: Bel; Max Current Rating: 40A; Power Dissipation: 600mW; Trip Current: 750mA; Time to Trip: 0.1s; Approvals: UL,TUV; Supplier 1: Mouser; Supplier Part Number 1: 530-0ZCJ0035AF2E; Manufacturer Part Number: 0ZCJ0035AF2E; RoHS: Yes; Category: Fuses; Stock 1: 19724; Pricing 1: 1=0.17000, 10=0.16700, 25=0.15400, 100=0.11700, 250=0.10600, 500=0.09000 (USD); Mount: Surface Mount; Case/Package: 1206; Case Code (Metric): 3216; Case Code (Imperial): 1206; Contact Plating: Tin,Matte; Number of Terminals: 2; Min Operating Temperature: -40°C; Max Operating Temperature: 85°C; Package Quantity: 3000; Packaging: Tape and Reel; Hold Current: 350mA; Max Voltage Rating (DC): 30V; Lead Free: Lead Free; ComponentLink1URL: https://datasheet.ciiva.com/18550/0zcj-18550696.pdf?src-supplier=Digi-Key; ComponentLink1Description: https://datasheet.ciiva.com/18550/0zcj-18550696.pdf?src-supplier=Digi-Key; ComponentLink2URL: https://datasheet.ciiva.com/18550/0zcj-18550697.pdf?src-supplier=Digi-Key; ComponentLink2Description: https://datasheet.ciiva.com/18550/0zcj-18550697.pdf?src-supplier=Digi-Key
P1 = Header 6: Header, 6-Pin; LatestRevisionDate: 17-Jul-2002; LatestRevisionNote: Re-released for DXP Platform.; Publisher: Altium Limited

## Sheet CAN.SchDoc
size Letter; Organization: Altium Limited; Address1: L3, 12a Rodborough Rd; Address2: Frenchs Forest; Address3: NSW; Address4: Australia 2086; DocumentNumber: D_13; SheetNumber: 13; SheetTotal: 21
Used 2 times, as channels U_MC3_blocks/U_MC3_module/U_CAN, U_MC3_blocks/U_MC3_module/U_CAN2. Parts and nets are listed once, with the designators drawn on the sheet.
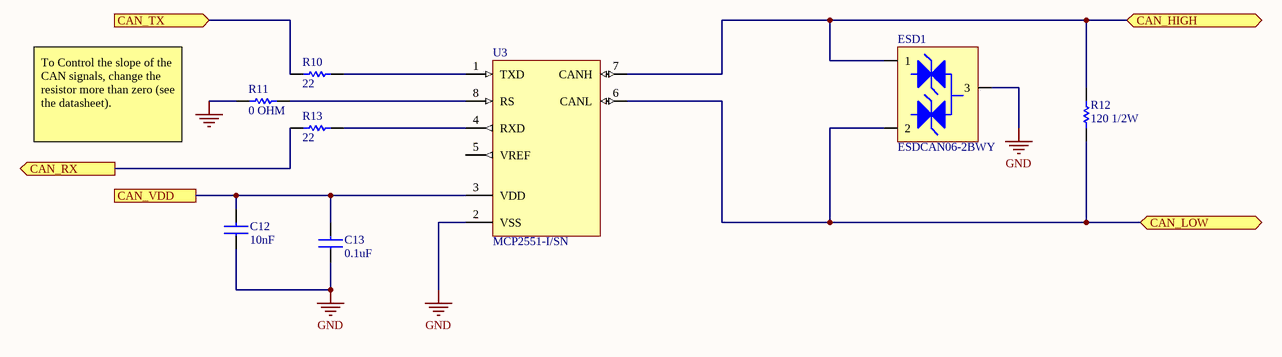
[diagram p3: CAN.SchDoc]

### Parts
C12  10nF  [C0805]
C13  0.1uF  [C0805]
ESD1  ESDCAN06-2BWY  [SOT65P210X110-3N]
R10  22  [R0805]
R11  0 OHM  [R0805]
R12  120 1/2W  [RESC3225X60X45NL20T20]
R13  22  [R0805]
U3  MCP2551-I/SN  [SOIC-SN8_N]

### Ports
CAN_HIGH (bidir), CAN_LOW (bidir), CAN_RX (out), CAN_TX (in), CAN_VDD

### Nets
GND: C12.1 C13.1 ESD1.3 R11.1 U3.2(VSS)
CAN_HIGH: ESD1.1 R12.2 U3.7(CANH) ; port CAN_HIGH
CAN_LOW: ESD1.2 R12.1 U3.6(CANL) ; port CAN_LOW
CAN_RX: R13.1 ; port CAN_RX
CAN_TX: R10.1 ; port CAN_TX
CAN_VDD: C12.2 C13.2 U3.3(VDD) ; port CAN_VDD
NetR10_2: R10.2 U3.1(TXD)
NetR11_2: R11.2 U3.8(RS)
NetR13_2: R13.2 U3.4(RXD)

Not connected (* = marked no-connect by the designer): U3 5(VREF)

### Channels
U_MC3_blocks/U_MC3_module/U_CAN: designators end in _U_CAN; ports CAN_HIGH=NetBH35_1 CAN_LOW=NetBH39_1 CAN_RX=CAN1_RX CAN_TX=CAN1_TX CAN_VDD=+5VSW
U_MC3_blocks/U_MC3_module/U_CAN2: designators end in _U_CAN2; ports CAN_HIGH=CTRL_CANH CAN_LOW=CTRL_CANL CAN_RX=CAN2_RX CAN_TX=CAN2_TX CAN_VDD=+5V

### Notes on the sheet
- To Control the slope of the CAN signals, change the resistor more than zero (see the datasheet).
- Title
- Size:
- Date:
- Letter
- Number:
- Time:
- Revision:
- Sheet
- of
- Fluid Power Training
- Institute Inc.
- 2170 S 3040 W
- Salt Lake City, 84119,UT.
- United States.
- File:

### Library data of the parts
C12 = CC0805KRX7R9BB103: YAGEO - CC0805KRX7R9BB103 - SMD Multilayer Ceramic Capacitor, 10000 pF, 50 V, 0805 [2012 Metric], ± 10%, X7R, CC Series; Voltage Rating (DC): 50V; Insulation Resistance: 100GR; Supplier 1: Mouser; Supplier Part Number 1: 603-CC805KRX7R9BB103; Manufacturer: Yageo; Manufacturer Part Number: CC0805KRX7R9BB103; RoHS: Yes; Category: Ceramic Capacitors; Stock 1: 473100; Pricing 1: 1=0.11000, 10=0.05700, 100=0.02600, 1000=0.02100, 4000=0.01600, 8000=0.01400 (USD); Mount: Surface Mount; Case/Package: 0805; Number of Pins: 2; Case Code (Metric): 2012; Case Code (Imperial): 0805; Material: Ceramic; Min Operating Temperature: -55°C; Max Operating Temperature: 125°C; Tolerance: 10%; Capacitance: 10nF; Dielectric: X7R; Packaging: Tape and Reel; Termination: SMD/SMT; Voltage Rating: 50V; Package Quantity: 1; Voltage: 50V; Composition: Ceramic; Length: 2mm; Height: 0.6mm; Width: 1.25mm; Depth: 1.25mm; Thickness: 0.024inch; Radiation Hardening: No; Lead Free: Lead Free; REACH SVHC: No SVHC; Halogen Free: Halogen Free; ComponentLink1URL: https://datasheet.ciiva.com/11786/0900766b80d84f1d-11786119.pdf?src-supplier=RSComponents; ComponentLink1Description: https://datasheet.ciiva.com/11786/0900766b80d84f1d-11786119.pdf?src-supplier=RSComponents; ComponentLink2URL: https://datasheet.ciiva.com/25613/0900766b8027bcf6-25613113.pdf?src-supplier=RSComponents; ComponentLink2Description: https://datasheet.ciiva.com/25613/0900766b8027bcf6-25613113.pdf?src-supplier=RSComponents; ComponentLink3URL: https://datasheet.ciiva.com/144/mlccorderingcode-144533.pdf?src-supplier=Digi-Key; ComponentLink3Description: https://datasheet.ciiva.com/144/mlccorderingcode-144533.pdf?src-supplier=Digi-Key; ComponentLink4URL: https://datasheet.ciiva.com/144/mlccorderingcode-144534.pdf?src-supplier=Digi-Key; ComponentLink4Description: https://datasheet.ciiva.com/144/mlccorderingcode-144534.pdf?src-supplier=Digi-Key; ComponentLink5URL: https://datasheet.ciiva.com/46372/1784427-46372638.pdf?src-supplier=Element14; ComponentLink5Description: https://datasheet.ciiva.com/46372/1784427-46372638.pdf?src-supplier=Element14; ComponentLink6URL: https://datasheet.ciiva.com/144/mlccorderingcode-144532.pdf?src-supplier=Digi-Key; ComponentLink6Description: https://datasheet.ciiva.com/144/mlccorderingcode-144532.pdf?src-supplier=Digi-Key; ComponentLink7URL: https://datasheet.ciiva.com/16625/upy-gphc-x7r-6-3v-to-50v-8-16625548.pdf?src-supplier=Avnet+Europe; ComponentLink7Description: https://datasheet.ciiva.com/16625/upy-gphc-x7r-6-3v-to-50v-8-16625548.pdf?src-supplier=Avnet+Europe; ComponentLink8URL: https://datasheet.ciiva.com/22749/1489800-22749215.pdf?src-supplier=Element14; ComponentLink8Description: https://datasheet.ciiva.com/22749/1489800-22749215.pdf?src-supplier=Element14; ComponentLink9URL: https://datasheet.ciiva.com/46372/1734573-46372639.pdf?src-supplier=Element14; ComponentLink9Description: https://datasheet.ciiva.com/46372/1734573-46372639.pdf?src-supplier=Element14
C13 = C0805C104K5RACTU: as C3 on sheet Main_Connectors; Manufacturer Part Number: C0805C104K5RACTU; RoHS: Yes; Stock 1: 4177670; Pricing 1: 1=0.17000, 10=0.10400, 100=0.05600, 500=0.03900, 1000=0.03200, 4000=0.02400 (USD); Supplier 1: Mouser; Supplier Part Number 1: 80-C0805C104K5R; Category: Ceramic Capacitors; Mount: Surface Mount,PCB; Case/Package: 0805; Number of Pins: 2; Case Code (Imperial): 0805; Case Code (Metric): 2012; Dielectric Material: Ceramic; Contact Plating: Tin,Matte; Min Operating Temperature: -55°C; Max Operating Temperature: 125°C; Voltage Rating: 50V; Tolerance: 10%; Packaging: Tape and Reel; Dielectric: X7R; Package Quantity: 4000; Voltage Rating (DC): 50V; Termination: SMD/SMT; Length: 2mm; Height: 0.9mm; Width: 1.2mm; Depth: 1.25mm; Thickness: 0.035inch; Lead Pitch: 0.75mm; Radiation Hardening: No; REACH SVHC: No SVHC; ComponentLink1URL: https://datasheet.ciiva.com/14589/70095383-14589048.pdf?src-supplier=Allied+Electronics; ComponentLink1Description: https://datasheet.ciiva.com/14589/70095383-14589048.pdf?src-supplier=Allied+Electronics; ComponentLink2URL: https://datasheet.ciiva.com/28682/1851736-28682232.pdf?src-supplier=Element14; ComponentLink2Description: https://datasheet.ciiva.com/28682/1851736-28682232.pdf?src-supplier=Element14; ComponentLink3URL: https://datasheet.ciiva.com/32431/slceramic-chip-condensers-e-32431755.pdf?src-supplier=Distrelec; ComponentLink3Description: https://datasheet.ciiva.com/32431/slceramic-chip-condensers-e-32431755.pdf?src-supplier=Distrelec; ComponentLink4URL: https://datasheet.ciiva.com/18410/70095383-18410815.pdf?src-supplier=Allied+Electronics; ComponentLink4Description: https://datasheet.ciiva.com/18410/70095383-18410815.pdf?src-supplier=Allied+Electronics
ESD1 = ESDCAN06-2BWY: TVS DIODE 35V 59V SOT323-3; Manufacturer: STMicroelectronics; Supplier 1: Mouser; Supplier Part Number 1: 511-ESDCAN06-2BWY; Manufacturer Part Number: ESDCAN06-2BWY; RoHS: No; Category: TVS Diodes; Stock 1: 4203; Pricing 1: 1=0.42000, 10=0.29500, 100=0.13600, 1000=0.10400, 3000=0.08900, 9000=0.08100 (USD); ComponentLink1URL: https://www.st.com/resource/en/datasheet/esdcan06-2bwy.pdf?src-supplier=Digi-Key; ComponentLink1Description: https://www.st.com/resource/en/datasheet/esdcan06-2bwy.pdf?src-supplier=Digi-Key
R10 R13 = CRCW080522R0JNEA: Resistor;  Thick Film;  22 Ohms;  0.125 W;  5%;  SMT;  0805;  TCR 73 ppm/DegC;  Cut Tape; Manufacturer: Vishay Dale; Resistance: 22R; Power Rating: 125mW; Temperature Coefficient: 200ppm/°C; Voltage Rating: 150V; Supplier 1: Mouser; Manufacturer Part Number: CRCW080522R0JNEA; RoHS: Yes; Category: Chip SMD Resistors; Stock 1: 32788; Pricing 1: 1=0.10000, 10=0.03900, 100=0.01500, 1000=0.00600, 5000=0.00400, 10000=0.00400 (USD); Case/Package: 0805; Contact Plating: Tin; Min Operating Temperature: -55°C; Max Operating Temperature: 155°C; Composition: Thick Film; Termination: Solder; Tolerance: 5%; Length: 2mm; Lead Free: Lead Free; ComponentLink1URL: https://datasheet.ciiva.com/28606/1847332-28606766.pdf?src-supplier=Element14; ComponentLink1Description: https://datasheet.ciiva.com/28606/1847332-28606766.pdf?src-supplier=Element14; ComponentLink2URL: https://datasheet.ciiva.com/22871/70201119-22871903.pdf?src-supplier=Allied+Electronics; ComponentLink2Description: https://datasheet.ciiva.com/22871/70201119-22871903.pdf?src-supplier=Allied+Electronics; Supplier Part Number 1: 71-CRCW080522R0JNEA; Weight: 0.000194oz; Case Code (Imperial): 0805; Case Code (Metric): 2012; Packaging: Tape and Reel; Number of Terminations: 2; Max Power Dissipation: 125mW; Package Quantity: 5000; Voltage Rating (DC): 150V; Features: Automotive AEC-Q200; Military Standard: Not; Height: 0.02inch; Width: 1.25mm; Depth: 1.25mm; Radiation Hardening: No; REACH SVHC: Unknown; ComponentLink3URL: https://datasheet.ciiva.com/2464/dcrcwe3-2464258.pdf?src-supplier=Digi-Key; ComponentLink3Description: https://datasheet.ciiva.com/2464/dcrcwe3-2464258.pdf?src-supplier=Digi-Key; ComponentLink4URL: https://datasheet.ciiva.com/16358/dcrcwe3-16358364.pdf?src-supplier=Future+Electronics; ComponentLink4Description: https://datasheet.ciiva.com/16358/dcrcwe3-16358364.pdf?src-supplier=Future+Electronics; ComponentLink5URL: https://datasheet.ciiva.com/16769/70201119-16769711.pdf?src-supplier=Allied+Electronics; ComponentLink5Description: https://datasheet.ciiva.com/16769/70201119-16769711.pdf?src-supplier=Allied+Electronics
R11 = RK73Z2ATTD: Res Thick Film 0805 0 Ohm Pad SMD Automotive T/R; Manufacturer: KOA Speer; Resistance: 0mR; Tolerance: 1%; Power Rating: 2W; Temperature Coefficient: 400ppm/°C; Supplier 1: Mouser; Supplier Part Number 1: 660-RK73Z2ATTD; Manufacturer Part Number: RK73Z2ATTD; RoHS: Yes; Category: Chip SMD Resistors; Stock 1: 381276; Pricing 1: 1=0.10000, 10=0.09500, 100=0.09500, 1000=0.09500, 5000=0.00500, 10000=0.00400 (USD); Case/Package: 0805; Case Code (Imperial): 0805; Case Code (Metric): 2012; Min Operating Temperature: -55°C; Max Operating Temperature: 155°C; Packaging: Tape and Reel; Composition: Thick Film; Package Quantity: 5000; Termination: SMD/SMT; Military Standard: Not; Length: 2mm; Height: 0.5mm; Width: 1.25mm; Depth: 1.25mm; Lead Free: Lead Free; REACH SVHC: Unknown; ComponentLink1URL: https://datasheet.ciiva.com/7816/549012-7816885.pdf?src-supplier=Element14; ComponentLink1Description: https://datasheet.ciiva.com/7816/549012-7816885.pdf?src-supplier=Element14; ComponentLink2URL: https://datasheet.ciiva.com/15159/getdatasheetpartid-91633-15159914.pdf?src-supplier=Verical; ComponentLink2Description: https://datasheet.ciiva.com/15159/getdatasheetpartid-91633-15159914.pdf?src-supplier=Verical; ComponentLink3URL: https://datasheet.ciiva.com/48463/rk73z-series-eng-jap-tds-48463436.pdf?src-supplier=Distrelec; ComponentLink3Description: https://datasheet.ciiva.com/48463/rk73z-series-eng-jap-tds-48463436.pdf?src-supplier=Distrelec
R12 = CRCW1210120RFKEA: Thick Film Resistors - SMD 1/2watt 120ohms 1%; Manufacturer: Vishay; Resistance: 120R; Temperature Coefficient: 100ppm/°C; Power Rating: 500mW; Voltage Rating: 200V; Supplier 1: Mouser; Supplier Part Number 1: 71-CRCW1210F-120-E3; Manufacturer Part Number: CRCW1210120RFKEA; RoHS: Yes; Category: Chip SMD Resistors; Stock 1: 16273; Pricing 1: 1=0.25000, 10=0.21500, 100=0.08400, 1000=0.03200, 5000=0.02600, 10000=0.02400 (USD); Case/Package: 1210; Weight: 0.000564oz; Case Code (Metric): 3225; Case Code (Imperial): 1210; Contact Plating: Tin; Min Operating Temperature: -55°C; Max Operating Temperature: 155°C; Tolerance: 1%; Packaging: Tape and Reel; Package Quantity: 1; Composition: Thick Film; Voltage Rating (DC): 200V; Number of Terminations: 2; Max Power Dissipation: 500mW; Termination: SMD/SMT; Military Standard: Not; Features: Automotive AEC-Q200; Length: 3.2mm; Height: 0.024inch; Width: 0.098inch; Depth: 2.5mm; Radiation Hardening: No; Lead Free: Lead Free; REACH SVHC: Unknown; ComponentLink1URL: https://datasheet.ciiva.com/8899/dcrcwe3-8899640.pdf?src-supplier=Avnet; ComponentLink1Description: https://datasheet.ciiva.com/8899/dcrcwe3-8899640.pdf?src-supplier=Avnet; ComponentLink2URL: https://datasheet.ciiva.com/7777/1697337-7777595.pdf?src-supplier=Element14; ComponentLink2Description: https://datasheet.ciiva.com/7777/1697337-7777595.pdf?src-supplier=Element14; ComponentLink3URL: https://datasheet.ciiva.com/8897/dcrcwe3-8897165.pdf?src-supplier=Avnet; ComponentLink3Description: https://datasheet.ciiva.com/8897/dcrcwe3-8897165.pdf?src-supplier=Avnet; ComponentLink4URL: https://datasheet.ciiva.com/5549/dcrcwe3-109170-5549774.pdf?src-supplier=Mouser; ComponentLink4Description: https://datasheet.ciiva.com/5549/dcrcwe3-109170-5549774.pdf?src-supplier=Mouser
U3 = MCP2551-I/SN: IC TRANSCEIVER CAN HI-SPD 8-SOIC; Manufacturer: Microchip; Operating Supply Voltage: 5V; Data Rate: 1Mbps; Max Supply Voltage: 5.5V; Min Supply Voltage: 4.5V; Number of Transceivers: 1; Nominal Supply Current: 75mA; Slew Rate: 8.5V/µs; Supplier 1: Mouser; Supplier Part Number 1: 579-MCP2551-I/SN; Manufacturer Part Number: MCP2551-I/SN; RoHS: Yes; Category: Interface ICs; Stock 1: 27114; Pricing 1: 1=1.02000, 10=1.02000, 25=0.85000, 100=0.82500, 250=0.82500, 500=0.82500 (USD); Mount: Surface Mount; Case/Package: SOIC; Number of Pins: 8; Contact Plating: Tin,Matte; Number of Terminals: 8; Min Operating Temperature: -40°C; Max Operating Temperature: 85°C; Package Quantity: 100; Interface: CAN; Packaging: Rail/Tube; Max Supply Current: 75mA; Number of Drivers: 1; Number of Receivers: 1; Number of Transmit Buffers: 1; Number of Receive Buffers: 1; Logic Function: Transceiver; Length: 4.9mm; Height: 1.25mm; Width: 3.9mm; Radiation Hardening: No; REACH SVHC: No SVHC; Lead Free: Lead Free; ComponentLink1URL: https://datasheet.ciiva.com/8084/jp011797-8084592.pdf?src-supplier=Avnet; ComponentLink1Description: https://datasheet.ciiva.com/8084/jp011797-8084592.pdf?src-supplier=Avnet; ComponentLink2URL: https://datasheet.ciiva.com/27056/2040583-27056423.pdf?src-supplier=Jameco; ComponentLink2Description: https://datasheet.ciiva.com/27056/2040583-27056423.pdf?src-supplier=Jameco; ComponentLink3URL: https://datasheet.ciiva.com/1495/21667f-1495089.pdf?src-supplier=Element14; ComponentLink3Description: https://datasheet.ciiva.com/1495/21667f-1495089.pdf?src-supplier=Element14; ComponentLink4URL: https://datasheet.ciiva.com/1700/21667f-1700023.pdf?src-supplier=Digi-Key; ComponentLink4Description: https://datasheet.ciiva.com/1700/21667f-1700023.pdf?src-supplier=Digi-Key; ComponentLink5URL: https://datasheet.ciiva.com/14152/eb644223-644224-e-14152540.pdf?src-supplier=Distrelec; ComponentLink5Description: https://datasheet.ciiva.com/14152/eb644223-644224-e-14152540.pdf?src-supplier=Distrelec; ComponentLink6URL: https://datasheet.ciiva.com/17649/jp011797-17649039.pdf?src-supplier=Avnet+Europe; ComponentLink6Description: https://datasheet.ciiva.com/17649/jp011797-17649039.pdf?src-supplier=Avnet+Europe